# EAGLE schematic PowerNode2 (EAGLE 9.5.2)
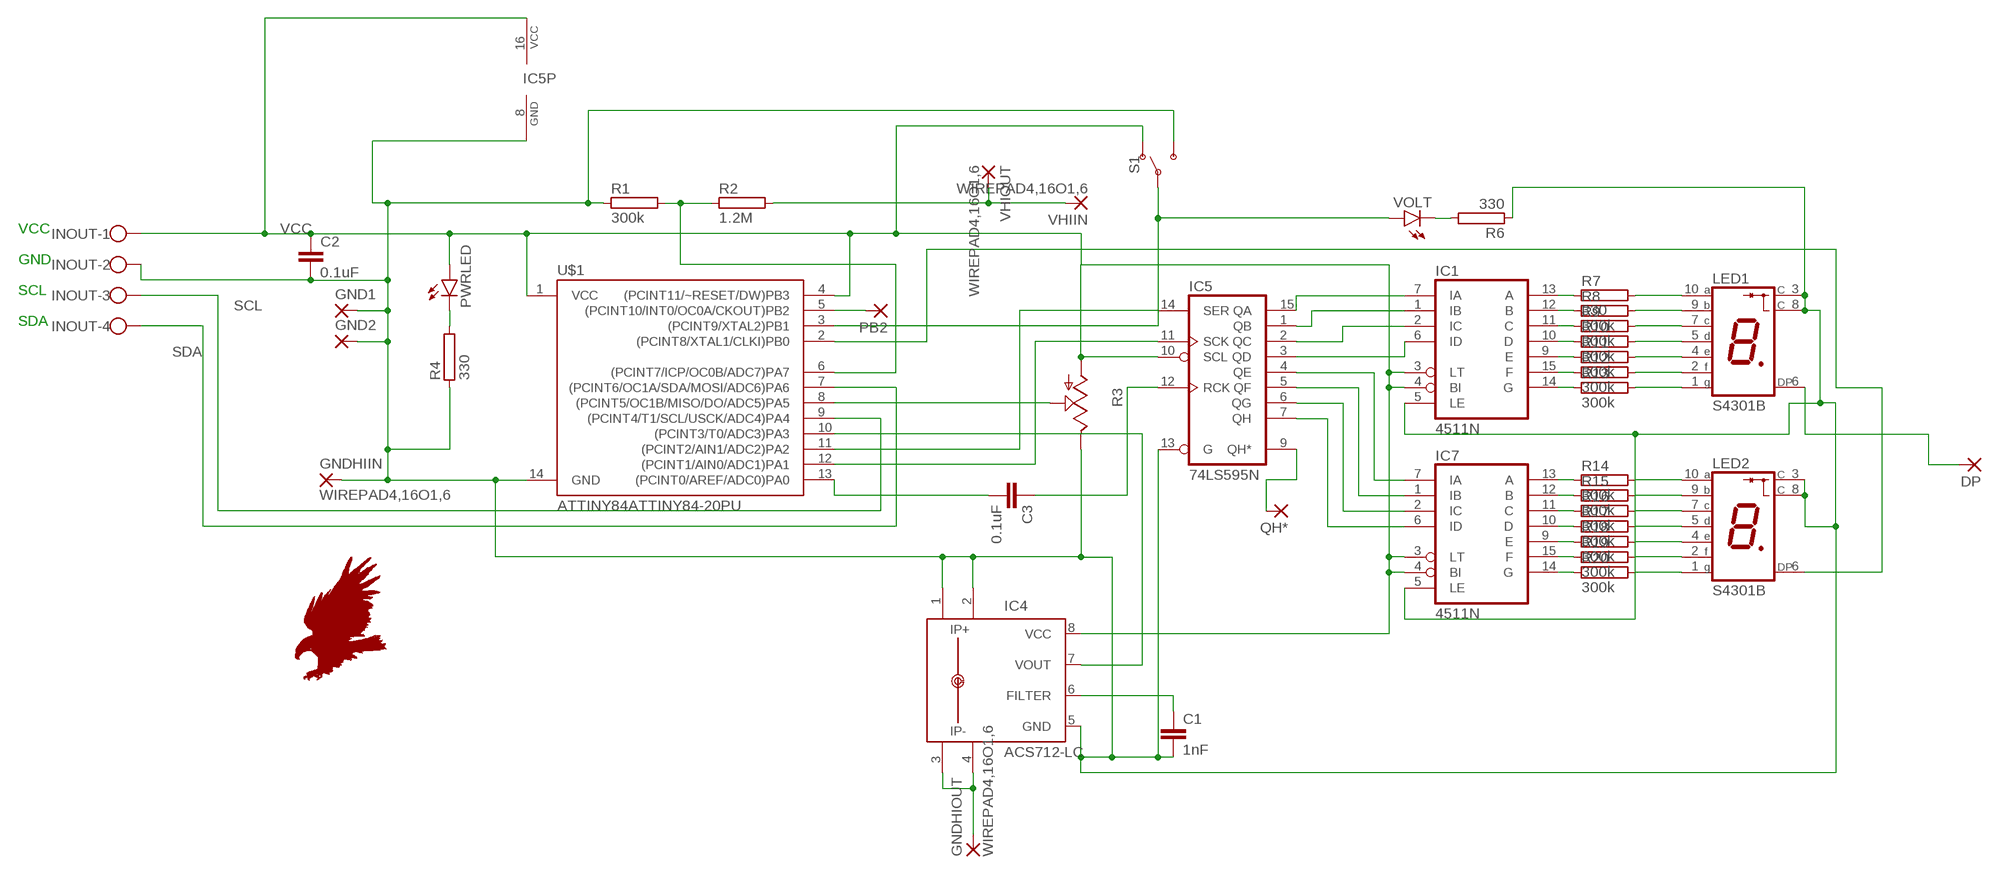
[diagram p0: schematic, sheet 1]

## Parts
C1  1nF  C5/3  [C5B3]
C2  0.1uF  C5/3  [C5B3]
C3  0.1uF  C5/3  [C5B3]
DP  2,54/0,9  [2,54/0,9]
GND1  2,15/1,0  [2,15/1,0]
GND2  2,15/1,0  [2,15/1,0]
GNDHIIN  WIREPAD4,16O1,6  [4,16O1,6]
GNDHIOUT  WIREPAD4,16O1,6  [4,16O1,6]
IC1  4511N  [DIL16]
IC4  ACS712-LC  [SOIC8]
IC5  74LS595N  [DIL16]
IC7  4511N  [DIL16]
INOUT  W237-4  [W237-4]
LED1  S4301B  [S4301B]
LED2  S4301B  [S4301B]
PB2  2,54/0,9  [2,54/0,9]
PWRLED  LED5MM  [LED5MM]
QH*  2,54/0,9  [2,54/0,9]
R1  300k  RKH206-8R  [KH206-8R]
R2  1.2M  RKH206-8R  [KH206-8R]
R3  TRIM_US-B25P  [B25P]
R4  330  RKH206-8R  [KH206-8R]
R6  330  RKH206-8R  [KH206-8R]
R7  330  RKH206-8R  [KH206-8R]
R8  300k  RKH206-8R  [KH206-8R]
R9  300k  RKH206-8R  [KH206-8R]
R10  300k  RKH206-8R  [KH206-8R]
R11  300k  RKH206-8R  [KH206-8R]
R12  300k  RKH206-8R  [KH206-8R]
R13  300k  RKH206-8R  [KH206-8R]
R14  300k  RKH206-8R  [KH206-8R]
R15  300k  RKH206-8R  [KH206-8R]
R16  300k  RKH206-8R  [KH206-8R]
R17  300k  RKH206-8R  [KH206-8R]
R18  300k  RKH206-8R  [KH206-8R]
R19  300k  RKH206-8R  [KH206-8R]
R20  300k  RKH206-8R  [KH206-8R]
S1  SWITCH-SPDT-PTH-11.6X4.0MM  [SWITCH_SPDT_PTH_11.6X4.0MM]
U$1  ATTINY84ATTINY84-20PU  [DIP14]
VHIIN  WIREPAD4,16O1,6  [4,16O1,6]
VHIOUT  WIREPAD4,16O1,6  [4,16O1,6]
VOLT  LED5MM  [LED5MM]

## Nets
CALIB: R3.S U$1.8((PCINT5/OC1B/MISO/DO/ADC5)PA5)
CURRIN: IC4.7(VOUT) U$1.10((PCINT3/T0/ADC3)PA3)
DISPSEL: S1.2(P) U$1.3((PCINT9/XTAL2)PB1) VOLT.A
GND [high power]: C1.2 C2.2 GND1.1(P) GND2.1(P) GNDHIIN.1(P) IC1.5(LE) IC4.1(IP+) IC4.2(IP+1) IC4.5(GND) IC5.8(GND) IC5.13(G) IC7.5(LE) INOUT.2 LED1.3(C) LED1.8(C) LED2.3(C) LED2.8(C) R1.1 R3.E R4.1 R6.1 S1.3(S) U$1.14(GND)
GNDHIOUT: GNDHIOUT.1(P) IC4.3(IP-) IC4.4(IP-1)
N$1: C1.1 IC4.6(FILTER)
N$2: IC5.14(SER) U$1.11((PCINT2/AIN1/ADC2)PA2)
N$3: IC1.13(A) R7.1
N$5: IC1.12(B) R8.1
N$7: IC1.11(C) R9.1
N$8: IC1.10(D) R10.1
N$9: IC1.9(E) R11.1
N$10: IC1.15(F) R12.1
N$11: IC1.14(G) R13.1
N$12: IC1.7(IA) IC5.15(QA)
N$13: IC1.1(IB) IC5.1(QB)
N$14: IC1.2(IC) IC5.2(QC)
N$15: IC1.6(ID) IC5.3(QD)
N$16: LED1.10(A) R7.2
N$17: LED1.9(B) R8.2
N$18: LED1.7(C) R9.2
N$19: LED1.5(D) R10.2
N$20: LED1.4(E) R11.2
N$21: LED1.2(F) R12.2
N$22: LED1.1(G) R13.2
N$23: IC7.13(A) R14.1
N$24: IC7.12(B) R15.1
N$25: IC7.11(C) R16.1
N$26: IC7.10(D) R17.1
N$27: IC7.9(E) R18.1
N$28: IC5.11(SCK) U$1.12((PCINT1/AIN0/ADC1)PA1)
N$29: C3.1 IC5.12(RCK)
N$30: C3.2 U$1.13((PCINT0/AREF/ADC0)PA0)
N$31: LED2.6(DP) U$1.2((PCINT8/XTAL1/CLKI)PB0)
N$32: PB2.1(P) U$1.5((PCINT10/INT0/OC0A/CKOUT)PB2)
N$33: PWRLED.K(C) R4.2
N$35: R6.2 VOLT.K(C)
N$37: IC5.9(QH*) QH*.1(P)
N$38: IC7.15(F) R19.1
N$39: DP.1(P) LED1.6(DP)
N$40: IC7.14(G) R20.1
N$41: LED2.10(A) R14.2
N$42: LED2.9(B) R15.2
N$43: LED2.7(C) R16.2
N$44: LED2.5(D) R17.2
N$45: LED2.4(E) R18.2
N$46: LED2.2(F) R19.2
N$47: LED2.1(G) R20.2
N$48: IC5.4(QE) IC7.7(IA)
N$49: IC5.5(QF) IC7.1(IB)
N$50: IC5.6(QG) IC7.2(IC)
N$51: IC5.7(QH) IC7.6(ID)
SCL: INOUT.3 U$1.9((PCINT4/T1/SCL/USCK/ADC4)PA4)
SDA: INOUT.4 U$1.7((PCINT6/OC1A/SDA/MOSI/ADC6)PA6)
VCC: C2.1 IC1.3(LT) IC1.4(BI) IC4.8(VCC) IC5.10(SCL) IC5.16(VCC) IC7.3(LT) IC7.4(BI) INOUT.1 PWRLED.A R3.A S1.1(O) U$1.1(VCC) U$1.4((PCINT11/~RESET/DW)PB3)
VHI [high power]: R2.2 VHIIN.1(P) VHIOUT.1(P)
VHIOUT: R1.2 R2.1 U$1.6((PCINT7/ICP/OC0B/ADC7)PA7)

## Notes on the sheet
- VCC
- GND
- SCL
- SDA

## Power pins joined to a net without a drawn wire
VDD: IC1.16(VDD) IC7.16(VDD)
VSS: IC1.8(VSS) IC7.8(VSS)

## Library data of the parts
C1-C3 = capacitor-wima:C: CAPACITOR naming: grid - package width
DP PB2 QH* = wirepad:2,54/0,9: THROUGH-HOLE PAD
GND1 GND2 = wirepad:2,15/1,0: THROUGH-HOLE PAD
GNDHIIN GNDHIOUT VHIIN VHIOUT = wirepad:WIREPAD: Wire PAD connect wire on PCB
IC1 IC7 = 45xx:4511: BCD to 7-segment LATCH/DECODER/DRIVER
IC4 = allegro-2:ACS712-LC
IC5 = 74xx-us:74*595: 8-bit SHIFT REGISTER, output latch
INOUT = con-wago-500:W237-4: WAGO SCREW CLAMP; OC_FARNELL: unknown; OC_NEWARK: unknown
LED1 LED2 = led-7-segment:S4301B: Single Digit Seven-Segment Display (cathode common) Source: LITEON .. S4301B.pdf; OC_FARNELL: unknown; OC_NEWARK: unknown
PWRLED VOLT = led:LED: LED OSRAM: - CHIPLED LG R971, LG N971, LY N971, LG Q971, LY Q971, LO R971, LY R971 LH N974, LH R974 LS Q976, LO Q976, LY Q976 LO Q996 - Hyper CHIPLED LW Q18S LB Q993, LB Q99A, LB R99A - SideLED LS A670, LO A670, LY A670, LG A670, LP A670 LB A673, LV A673, LT A673, LW A673 LH A674 LY A675 LS A676, LA A676, LO A676, LY A676, LW A676 LS A679, LY A679, LG A679 - Hyper Micro SIDELED® LS Y876, LA Y876, LO Y876, LY Y876 LT Y87S - SmartLED LW L88C, LW L88S LB L89C, LB L89S, LG L890 LS L89K, LO L89K, LY L89K LS L896, LA L896, LO L896, LY L896 - TOPLED LS T670, LO T670, LY T670, LG T670, LP T670 LSG T670, LSP T670, LSY T670, LOP T670, LYG T670 LG T671, LOG T671, LSG T671 LB T673, LV T673, LT T673, LW T673 LH T674 LS T676, LA T676, LO T676, LY T676, LB T676, LH T676, LSB T676, LW T676 LB T67C, LV T67C, LT T67C, LS T67K, LO T67K, LY T67K, LW E67C LS E67B, LA E67B, LO E67B, LY E67B, LB E67C, LV E67C, LT E67C LW T67C LS T679, LY T679, LG T679 LS T770, LO T770, LY T770, LG T770, LP T770 LB T773, LV T773, LT T773, LW T773 LH T774 LS E675, LA E675, LY E675, LS T675 LS T776, LA T776, LO T776, LY T776, LB T776 LHGB T686 LT T68C, LB T68C - Hyper Mini TOPLED® LB M676 - Mini TOPLED Santana® LG M470 LS M47K, LO M47K, LY M47K Source: http://www.osram.convergy.de LUXEON: - LUMILED® LXK2-PW12-R00, LXK2-PW12-S00, LXK2-PW14-U00, LXK2-PW14-V00 LXK2-PM12-R00, LXK2-PM12-S00, LXK2-PM14-U00 LXK2-PE12-Q00, LXK2-PE12-R00, LXK2-PE12-S00, LXK2-PE14-T00, LXK2-PE14-U00 LXK2-PB12-K00, LXK2-PB12-L00, LXK2-PB12-M00, LXK2-PB14-N00, LXK2-PB14-P00, LXK2-PB14-Q00 LXK2-PR12-L00, LXK2-PR12-M00, LXK2-PR14-Q00, LXK2-PR14-R00 LXK2-PD12-Q00, LXK2-PD12-R00, LXK2-PD12-S00 LXK2-PH12-R00, LXK2-PH12-S00 LXK2-PL12-P00, LXK2-PL12-Q00, LXK2-PL12-R00 Source: www.luxeon.com KINGBRIGHT: KA-3528ASYC Source: www.kingbright.com
R1 R2 R4 R6-R20 = resistor-power:R: Power Resitor; OC_FARNELL: unknown; OC_NEWARK: unknown
R3 = pot:TRIM_US-: POTENTIOMETER
S1 = SparkFun-Switches:SWITCH-SPDT: Single Pole, Double Throw (SPDT) Switch Single-pole, double-throw (SPDT) switch. Variant Overview SMD-AYZ0202 Surface Mount DPDT Switch <https://www.sparkfun.com/products/597> (COM-00597) Used on e.g. LilyPad Arduino USB - ATmega32U4 Board <https://www.sparkfun.com/products/12049> PTH-11.6X4.0MM SPDT Mini Power Switch <https://www.sparkfun.com/products/102> (COM-00102) Used on e.g. SparkFun Simon Says - Through-Hole Soldering Kit <https://www.sparkfun.com/products/10547> (KIT-10547) PTH-11.6X4.0MM-KIT KIT version of SPDT Mini Power Switch - Simplifies soldering by removing tStop of switch pins - only one side can be soldered. PTH-11.6X4.0MM-LOCK LOCK version of SPDT Mini Power Switch - Offset pins hold switch in place for easier soldering. SMD-RIGHT-ANGLE Surface Mount Right Angle Switch <https://www.sparkfun.com/products/10860> (COM-10860) Used on e.g. SparkFun ESP8266 Thing <https://www.sparkfun.com/products/13231>; PROD_ID: SWCH-08261; SF_SKU: COM-00102
U$1 = SparkFun-IC-Microcontroller:ATTINY84: Atmel 14-pin 2/4/8kB flash uC Datasheet <https://cdn.sparkfun.com/datasheets/Widgets/doc8006.pdf> SparkFun Products Tiny AVR Programmer <https://www.sparkfun.com/products/11801> (PGM-11801) SparkFun Servo Trigger - Continuous Rotation <https://www.sparkfun.com/products/13872> (WIG-13872) SparkFun Servo Trigger <https://www.sparkfun.com/products/13118> (WIG-13118)

## Net classes
0 default: width 0.508 mm, drill 0.305 mm, clearance 0.305 mm
1 high power: width 0.711 mm, drill 0.457 mm, clearance 0.457 mm